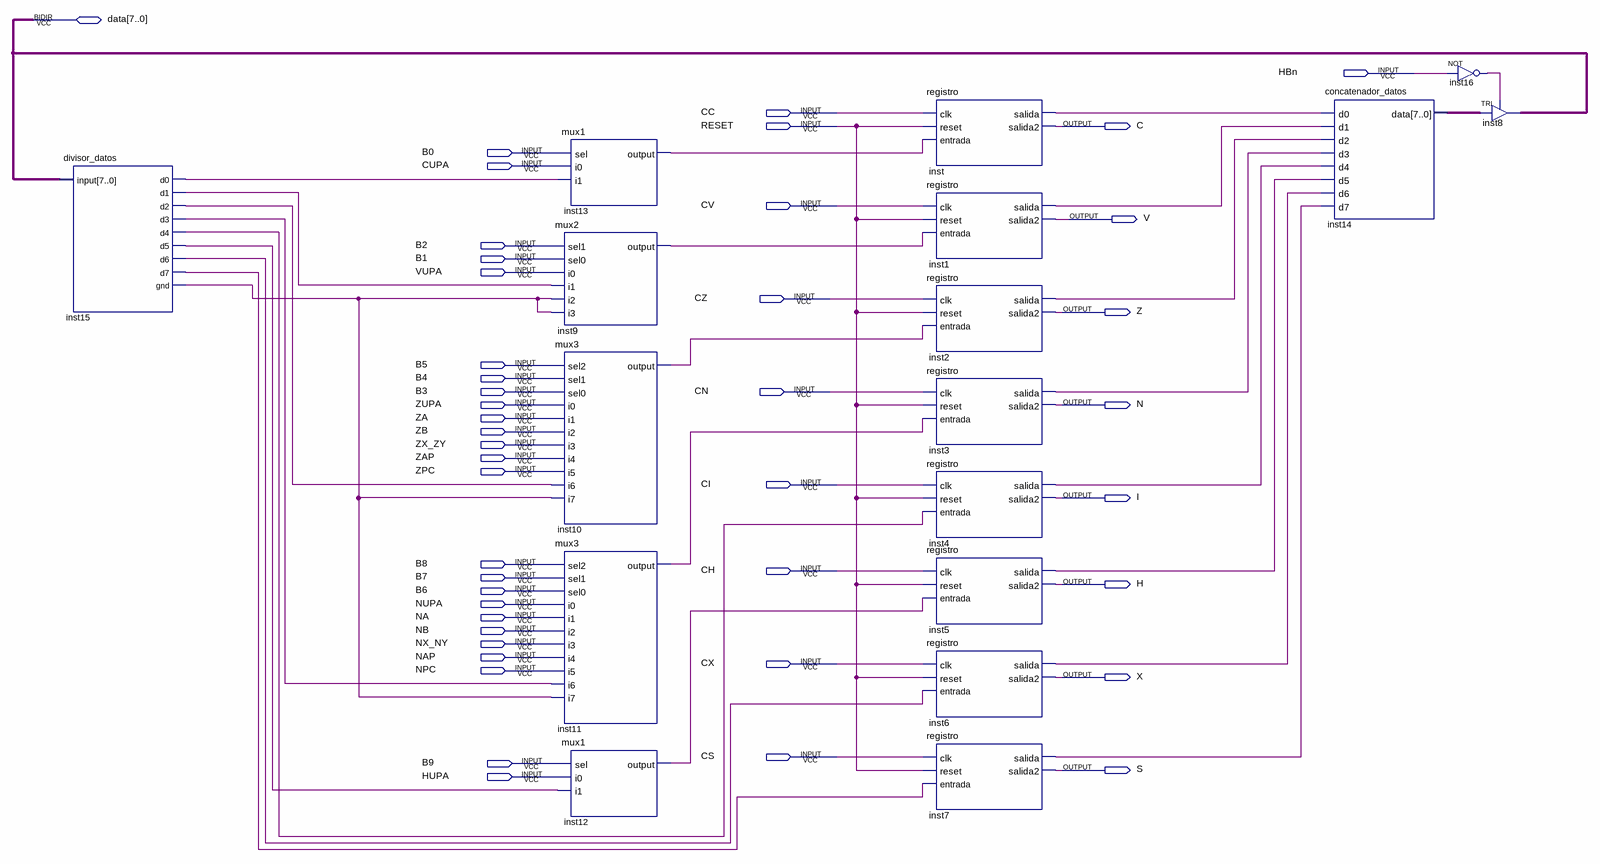
[diagram p0: schematic sheet]
// Quartus schematic Flags.bdf as structural Verilog: 17 symbols, 44 pins
module Flags (
  input  HBn,
  input  CC,
  input  RESET,
  input  B0,
  input  CUPA,
  input  CV,
  input  B2,
  input  B1,
  input  VUPA,
  input  CZ,
  input  B5,
  input  B4,
  input  B3,
  input  CN,
  input  ZUPA,
  input  ZA,
  input  ZB,
  input  ZX_ZY,
  input  ZAP,
  input  ZPC,
  input  CI,
  input  B8,
  input  CH,
  input  B7,
  input  B6,
  input  NUPA,
  input  NA,
  input  NB,
  input  NX_NY,
  input  NAP,
  input  CX,
  input  NPC,
  input  CS,
  input  B9,
  input  HUPA,
  inout  [7:0] data,
  output C,
  output V,
  output Z,
  output N,
  output I,
  output H,
  output X,
  output S
);

  wire inst1_salida, inst2_salida, inst3_salida, inst4_salida, inst5_salida, inst6_salida, inst7_salida,
       inst9_output, inst10_output, inst11_output, inst12_output, inst13_output, inst15_d0, inst15_d1,
       inst15_d2, inst15_d3, inst15_d4, inst15_d5, inst15_d6, inst15_d7, inst15_gnd, inst16_out, inst_salida;
  wire [7:0] inst14_data;

  divisor_datos inst15 (
    .\input (data), .d0(inst15_d0), .d1(inst15_d1), .d2(inst15_d2), .d3(inst15_d3), .d4(inst15_d4),
    .d5(inst15_d5), .d6(inst15_d6), .d7(inst15_d7), .gnd(inst15_gnd));
  mux1 inst13 (.sel(B0), .i0(CUPA), .i1(inst15_d0), .\output (inst13_output));
  mux2 inst9 (
    .sel1(B2), .sel0(B1), .i0(VUPA), .i1(inst15_d1), .i2(inst15_gnd), .i3(inst15_gnd), .\output (inst9_output));
  mux3 inst10 (
    .sel2(B5), .sel1(B4), .sel0(B3), .i0(ZUPA), .i1(ZA), .i2(ZB), .i3(ZX_ZY), .i4(ZAP), .i5(ZPC),
    .i6(inst15_d2), .i7(inst15_gnd), .\output (inst10_output));
  mux3 inst11 (
    .sel2(B8), .sel1(B7), .sel0(B6), .i0(NUPA), .i1(NA), .i2(NB), .i3(NX_NY), .i4(NAP), .i5(NPC),
    .i6(inst15_d3), .i7(inst15_gnd), .\output (inst11_output));
  mux1 inst12 (.sel(B9), .i0(HUPA), .i1(inst15_d5), .\output (inst12_output));
  registro inst (.clk(CC), .reset(RESET), .entrada(inst13_output), .salida(inst_salida), .salida2(C));
  registro inst1 (.clk(CV), .reset(RESET), .entrada(inst9_output), .salida(inst1_salida), .salida2(V));
  registro inst2 (.clk(CZ), .reset(RESET), .entrada(inst10_output), .salida(inst2_salida), .salida2(Z));
  registro inst3 (.clk(CN), .reset(RESET), .entrada(inst11_output), .salida(inst3_salida), .salida2(N));
  registro inst4 (.clk(CI), .reset(RESET), .entrada(inst15_d4), .salida(inst4_salida), .salida2(I));
  registro inst5 (.clk(CH), .reset(RESET), .entrada(inst12_output), .salida(inst5_salida), .salida2(H));
  registro inst6 (.clk(CX), .reset(RESET), .entrada(inst15_d6), .salida(inst6_salida), .salida2(X));
  registro inst7 (.clk(CS), .reset(RESET), .entrada(inst15_d7), .salida(inst7_salida), .salida2(S));
  concatenador_datos inst14 (
    .d0(inst_salida), .d1(inst1_salida), .d2(inst2_salida), .d3(inst3_salida), .d4(inst4_salida),
    .d5(inst5_salida), .d6(inst6_salida), .d7(inst7_salida), .data(inst14_data));
  not inst16 (inst16_out, HBn);
  TRI inst8[7:0] (.IN(inst14_data), .OE(inst16_out), .OUT(data));
endmodule
